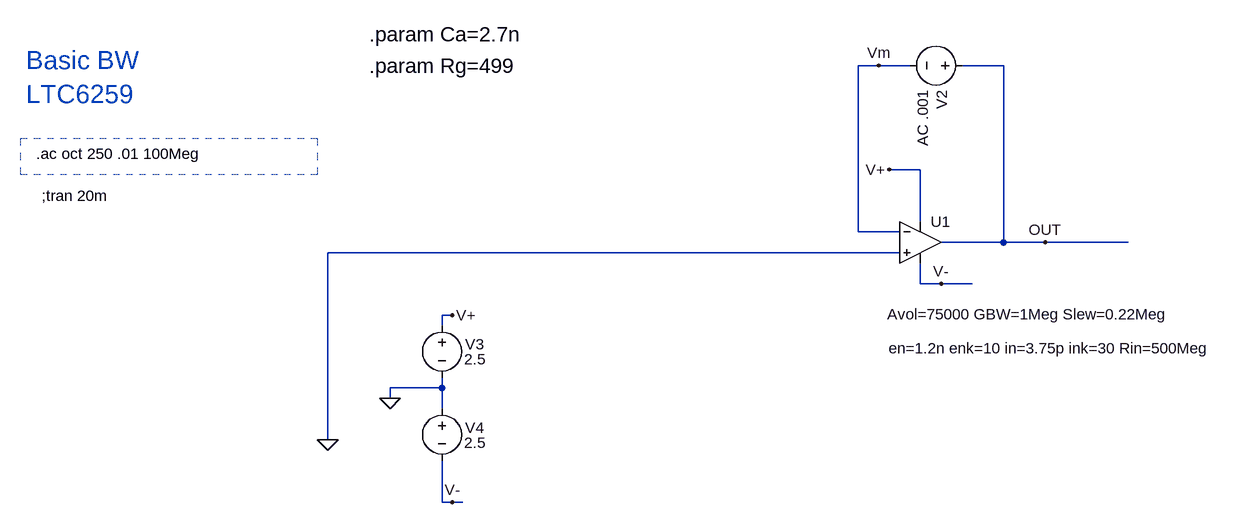
[diagram p0: schematic BasicBW_6259.asc]
BasicBW_6259.asc, the LTspice schematic file:
Version 4
SHEET 1 1928 1456
WIRE -4288 -3296 -4320 -3296
WIRE -4240 -3296 -4288 -3296
WIRE -4096 -3296 -4160 -3296
WIRE -4224 -3136 -4272 -3136
WIRE -4224 -3056 -4224 -3136
WIRE -4320 -3040 -4320 -3296
WIRE -4256 -3040 -4320 -3040
WIRE -4096 -3024 -4096 -3296
WIRE -4096 -3024 -4192 -3024
WIRE -4032 -3024 -4096 -3024
WIRE -3904 -3024 -4032 -3024
WIRE -4256 -3008 -5136 -3008
WIRE -4224 -2960 -4224 -2992
WIRE -4192 -2960 -4224 -2960
WIRE -4144 -2960 -4192 -2960
WIRE -4944 -2912 -4960 -2912
WIRE -4960 -2896 -4960 -2912
WIRE -4960 -2800 -4960 -2816
WIRE -4960 -2800 -5040 -2800
WIRE -5040 -2784 -5040 -2800
WIRE -4960 -2768 -4960 -2800
WIRE -5136 -2720 -5136 -3008
WIRE -4960 -2624 -4960 -2688
WIRE -4944 -2624 -4960 -2624
WIRE -4928 -2624 -4944 -2624
FLAG -5136 -2720 0
FLAG -4272 -3136 V+
FLAG -4944 -2912 V+
FLAG -5040 -2784 0
FLAG -4944 -2624 V-
FLAG -4192 -2960 V-
FLAG -4032 -3024 OUT
FLAG -4288 -3296 Vm
SYMBOL Opamps\\UniversalOpamp2 -4224 -3024 R0
WINDOW 123 -51 111 Left 2
WINDOW 40 -49 163 Left 2
SYMATTR Value2 Avol=75000 GBW=1Meg Slew=0.22Meg
SYMATTR SpiceLine2 en=1.2n enk=10 in=3.75p ink=30 Rin=500Meg
SYMATTR InstName U1
SYMBOL voltage -4960 -2912 R0
WINDOW 0 36 45 Left 2
WINDOW 3 34 68 Left 2
WINDOW 123 0 0 Left 2
WINDOW 39 0 0 Left 2
SYMATTR InstName V3
SYMATTR Value 2.5
SYMBOL voltage -4960 -2784 R0
WINDOW 0 36 45 Left 2
WINDOW 3 34 68 Left 2
WINDOW 123 0 0 Left 2
WINDOW 39 0 0 Left 2
SYMATTR InstName V4
SYMATTR Value 2.5
SYMBOL voltage -4144 -3296 R90
WINDOW 0 38 47 Left 2
WINDOW 3 137 76 Invisible 2
WINDOW 123 37 76 Left 2
WINDOW 39 0 0 Left 2
SYMATTR InstName V2
SYMATTR Value SINE(0 1 20K)
SYMATTR Value2 AC .001
TEXT -5584 -3160 Left 2 !.ac oct 250 .01 100Meg
TEXT -5072 -3344 Left 3 !.param Ca=2.7n
TEXT -5072 -3296 Left 3 !.param Rg=499
TEXT -5600 -3304 Left 4 ;Basic BW\nLTC6259
TEXT -5576 -3096 Left 2 !;tran 20m
RECTANGLE Normal -5152 -3128 -5608 -3184 2

The netlist it stands for:
* BasicBW_6259.asc
XU1 0 Vm V+ V- OUT level.2 Avol=75000 GBW=1Meg Slew=0.22Meg ilimit=25m rail=0 Vos=0 phimargin=45 en=1.2n enk=10 in=3.75p ink=30 Rin=500Meg  ; pins IN+ IN- V+ V- OUT
V3 V+ 0 2.5
V4 0 V- 2.5
V2 OUT Vm SINE(0 1 20K) AC .001
.ac oct 250 .01 100Meg
.param Ca=2.7n
.param Rg=499
* Basic BW
* LTC6259
;tran 20m
.lib UniversalOpamps2.sub
.backanno
.end